# Altium schematic sheet hierarchy.SchDoc
size A3; DocumentNumber: 1; SheetNumber: 1; SheetTotal: 19; SheetDescription: Overview
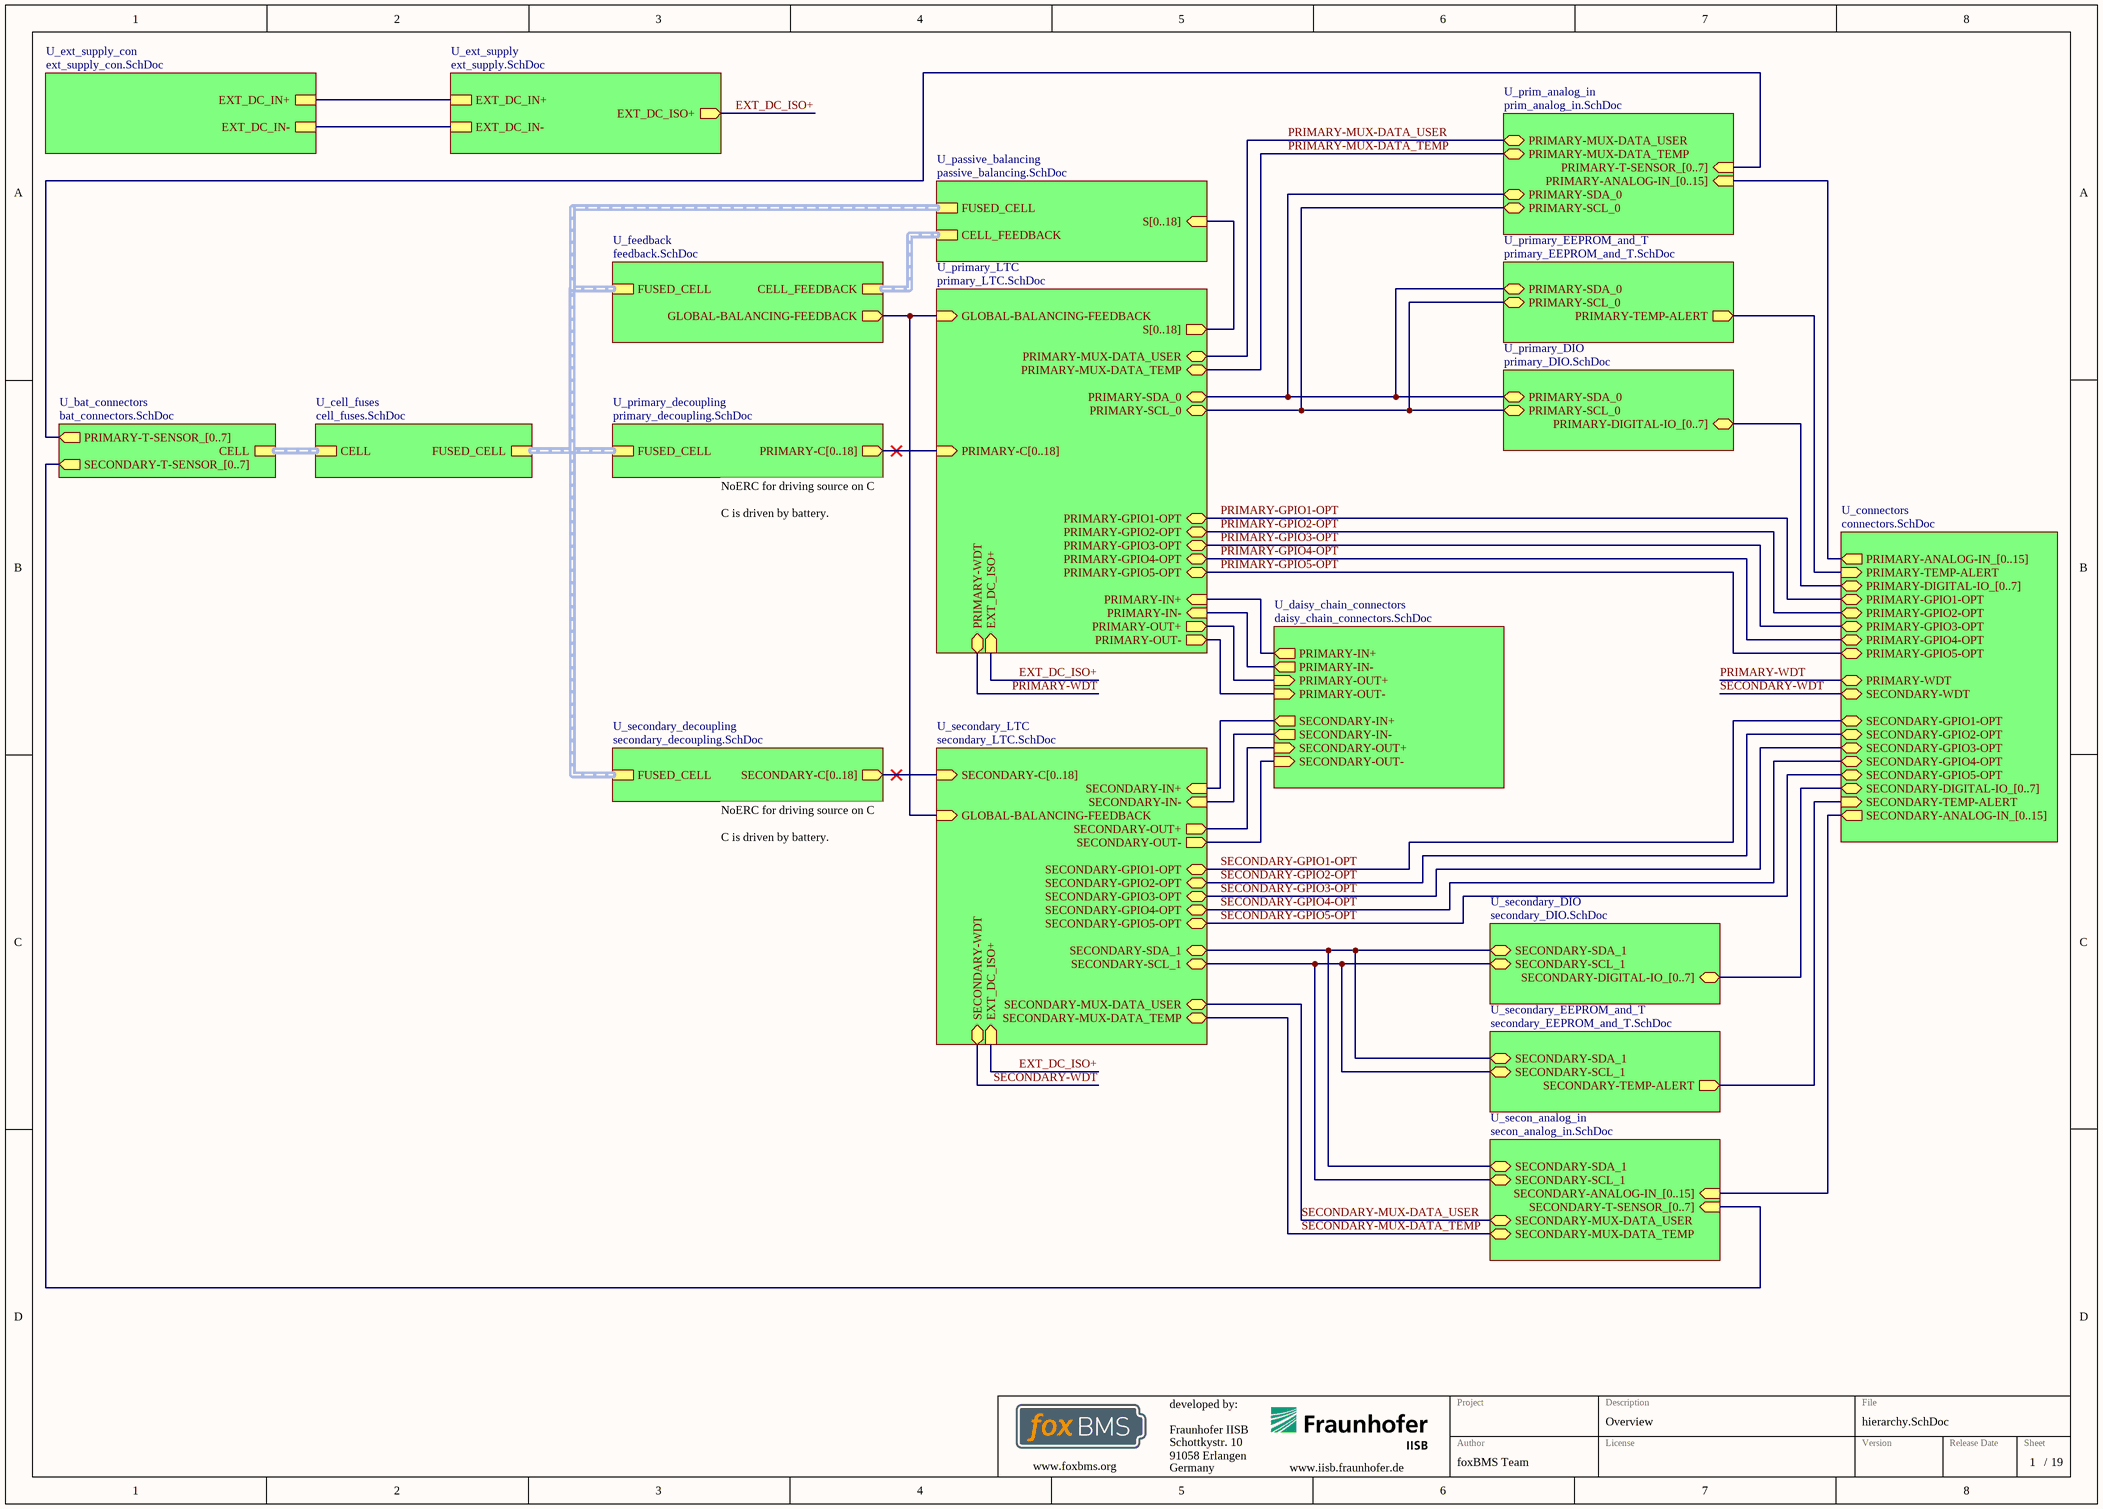
[diagram p0: hierarchy.SchDoc]

## Sub-sheets
U_bat_connectors = bat_connectors.SchDoc: CELL (harness CELL_VOLTAGES), PRIMARY-T-SENSOR_[0..7] (out), SECONDARY-T-SENSOR_[0..7] (out)
U_cell_fuses = cell_fuses.SchDoc: CELL (harness CELL_VOLTAGES), FUSED_CELL (harness CELL_VOLTAGES)
U_connectors = connectors.SchDoc: PRIMARY-WDT (bidir), SECONDARY-WDT (bidir), PRIMARY-GPIO1-OPT (bidir), PRIMARY-GPIO2-OPT (bidir), PRIMARY-GPIO3-OPT (bidir), PRIMARY-GPIO4-OPT (bidir), PRIMARY-GPIO5-OPT (bidir), SECONDARY-GPIO1-OPT (bidir), SECONDARY-GPIO2-OPT (bidir), SECONDARY-GPIO3-OPT (bidir), SECONDARY-GPIO4-OPT (bidir), SECONDARY-GPIO5-OPT (bidir), PRIMARY-TEMP-ALERT (in), SECONDARY-TEMP-ALERT (in), SECONDARY-DIGITAL-IO_[0..7] (bidir), PRIMARY-DIGITAL-IO_[0..7] (bidir), PRIMARY-ANALOG-IN_[0..15] (out), SECONDARY-ANALOG-IN_[0..15] (out)
U_daisy_chain_connectors = daisy_chain_connectors.SchDoc: SECONDARY-IN+ (out), SECONDARY-IN- (out), SECONDARY-OUT+ (in), SECONDARY-OUT- (in), PRIMARY-IN+ (out), PRIMARY-IN- (out), PRIMARY-OUT- (in), PRIMARY-OUT+ (in)
U_ext_supply = ext_supply.SchDoc: EXT_DC_IN+, EXT_DC_IN-, EXT_DC_ISO+ (out)
U_ext_supply_con = ext_supply_con.SchDoc: EXT_DC_IN+, EXT_DC_IN-
U_feedback = feedback.SchDoc: GLOBAL-BALANCING-FEEDBACK (out), CELL_FEEDBACK (harness CELL_FEEDBACK), FUSED_CELL (harness CELL_VOLTAGES)
U_passive_balancing = passive_balancing.SchDoc: FUSED_CELL (harness CELL_VOLTAGES), S[0..18] (in), CELL_FEEDBACK (harness CELL_FEEDBACK)
U_prim_analog_in = prim_analog_in.SchDoc: PRIMARY-MUX-DATA_TEMP (bidir), PRIMARY-MUX-DATA_USER (bidir), PRIMARY-ANALOG-IN_[0..15] (in), PRIMARY-T-SENSOR_[0..7] (in), PRIMARY-SCL_0 (bidir), PRIMARY-SDA_0 (bidir)
U_primary_decoupling = primary_decoupling.SchDoc: FUSED_CELL (harness CELL_VOLTAGES), PRIMARY-C[0..18] (out)
U_primary_DIO = primary_DIO.SchDoc: PRIMARY-SCL_0 (bidir), PRIMARY-SDA_0 (bidir), PRIMARY-DIGITAL-IO_[0..7] (bidir)
U_primary_EEPROM_and_T = primary_EEPROM_and_T.SchDoc: PRIMARY-TEMP-ALERT (out), PRIMARY-SCL_0 (bidir), PRIMARY-SDA_0 (bidir)
U_primary_LTC = primary_LTC.SchDoc: PRIMARY-IN- (in), PRIMARY-IN+ (in), PRIMARY-OUT- (out), PRIMARY-OUT+ (out), PRIMARY-GPIO5-OPT (bidir), PRIMARY-GPIO4-OPT (bidir), PRIMARY-MUX-DATA_USER (bidir), PRIMARY-GPIO1-OPT (bidir), PRIMARY-SCL_0 (bidir), PRIMARY-GPIO2-OPT (bidir), PRIMARY-MUX-DATA_TEMP (bidir), PRIMARY-GPIO3-OPT (bidir), GLOBAL-BALANCING-FEEDBACK (in), PRIMARY-SDA_0 (bidir), EXT_DC_ISO+ (in), PRIMARY-C[0..18] (in), S[0..18] (out), PRIMARY-WDT (bidir)
U_secon_analog_in = secon_analog_in.SchDoc: SECONDARY-MUX-DATA_TEMP (bidir), SECONDARY-MUX-DATA_USER (bidir), SECONDARY-ANALOG-IN_[0..15] (in), SECONDARY-T-SENSOR_[0..7] (in), SECONDARY-SCL_1 (bidir), SECONDARY-SDA_1 (bidir)
U_secondary_decoupling = secondary_decoupling.SchDoc: FUSED_CELL (harness CELL_VOLTAGES), SECONDARY-C[0..18] (out)
U_secondary_DIO = secondary_DIO.SchDoc: SECONDARY-SCL_1 (bidir), SECONDARY-SDA_1 (bidir), SECONDARY-DIGITAL-IO_[0..7] (bidir)
U_secondary_EEPROM_and_T = secondary_EEPROM_and_T.SchDoc: SECONDARY-TEMP-ALERT (out), SECONDARY-SDA_1 (bidir), SECONDARY-SCL_1 (bidir)
U_secondary_LTC = secondary_LTC.SchDoc: SECONDARY-GPIO5-OPT (bidir), SECONDARY-GPIO4-OPT (bidir), SECONDARY-MUX-DATA_USER (bidir), SECONDARY-GPIO1-OPT (bidir), SECONDARY-SDA_1 (bidir), SECONDARY-SCL_1 (bidir), SECONDARY-MUX-DATA_TEMP (bidir), SECONDARY-GPIO2-OPT (bidir), SECONDARY-GPIO3-OPT (bidir), GLOBAL-BALANCING-FEEDBACK (in), EXT_DC_ISO+ (in), SECONDARY-IN- (in), SECONDARY-IN+ (in), SECONDARY-OUT- (out), SECONDARY-OUT+ (out), SECONDARY-C[0..18] (in), SECONDARY-WDT (bidir)

## Nets
EXT_DC_ISO+: sheet U_ext_supply/EXT_DC_ISO+, sheet U_primary_LTC/EXT_DC_ISO+, sheet U_secondary_LTC/EXT_DC_ISO+
PRIMARY-GPIO1-OPT: sheet U_connectors/PRIMARY-GPIO1-OPT, sheet U_primary_LTC/PRIMARY-GPIO1-OPT
PRIMARY-GPIO2-OPT: sheet U_connectors/PRIMARY-GPIO2-OPT, sheet U_primary_LTC/PRIMARY-GPIO2-OPT
PRIMARY-GPIO3-OPT: sheet U_connectors/PRIMARY-GPIO3-OPT, sheet U_primary_LTC/PRIMARY-GPIO3-OPT
PRIMARY-GPIO4-OPT: sheet U_connectors/PRIMARY-GPIO4-OPT, sheet U_primary_LTC/PRIMARY-GPIO4-OPT
PRIMARY-GPIO5-OPT: sheet U_connectors/PRIMARY-GPIO5-OPT, sheet U_primary_LTC/PRIMARY-GPIO5-OPT
PRIMARY-MUX-DATA_TEMP: sheet U_primary_LTC/PRIMARY-MUX-DATA_TEMP, sheet U_prim_analog_in/PRIMARY-MUX-DATA_TEMP
PRIMARY-MUX-DATA_USER: sheet U_primary_LTC/PRIMARY-MUX-DATA_USER, sheet U_prim_analog_in/PRIMARY-MUX-DATA_USER
PRIMARY-WDT: sheet U_connectors/PRIMARY-WDT, sheet U_primary_LTC/PRIMARY-WDT
SECONDARY-GPIO1-OPT: sheet U_connectors/SECONDARY-GPIO1-OPT, sheet U_secondary_LTC/SECONDARY-GPIO1-OPT
SECONDARY-GPIO2-OPT: sheet U_connectors/SECONDARY-GPIO2-OPT, sheet U_secondary_LTC/SECONDARY-GPIO2-OPT
SECONDARY-GPIO3-OPT: sheet U_connectors/SECONDARY-GPIO3-OPT, sheet U_secondary_LTC/SECONDARY-GPIO3-OPT
SECONDARY-GPIO4-OPT: sheet U_connectors/SECONDARY-GPIO4-OPT, sheet U_secondary_LTC/SECONDARY-GPIO4-OPT
SECONDARY-GPIO5-OPT: sheet U_connectors/SECONDARY-GPIO5-OPT, sheet U_secondary_LTC/SECONDARY-GPIO5-OPT
SECONDARY-MUX-DATA_TEMP: sheet U_secondary_LTC/SECONDARY-MUX-DATA_TEMP, sheet U_secon_analog_in/SECONDARY-MUX-DATA_TEMP
SECONDARY-MUX-DATA_USER: sheet U_secondary_LTC/SECONDARY-MUX-DATA_USER, sheet U_secon_analog_in/SECONDARY-MUX-DATA_USER
SECONDARY-WDT: sheet U_connectors/SECONDARY-WDT, sheet U_secondary_LTC/SECONDARY-WDT
(unnamed): sheet U_ext_supply/EXT_DC_IN+, sheet U_ext_supply_con/EXT_DC_IN+
(unnamed): sheet U_ext_supply/EXT_DC_IN-, sheet U_ext_supply_con/EXT_DC_IN-
(unnamed): sheet U_connectors/PRIMARY-TEMP-ALERT, sheet U_primary_EEPROM_and_T/PRIMARY-TEMP-ALERT
(unnamed): sheet U_connectors/SECONDARY-TEMP-ALERT, sheet U_secondary_EEPROM_and_T/SECONDARY-TEMP-ALERT
(unnamed): sheet U_feedback/GLOBAL-BALANCING-FEEDBACK, sheet U_primary_LTC/GLOBAL-BALANCING-FEEDBACK, sheet U_secondary_LTC/GLOBAL-BALANCING-FEEDBACK
(unnamed): sheet U_primary_LTC/PRIMARY-IN-, sheet U_daisy_chain_connectors/PRIMARY-IN-
(unnamed): sheet U_primary_LTC/PRIMARY-IN+, sheet U_daisy_chain_connectors/PRIMARY-IN+
(unnamed): sheet U_primary_LTC/PRIMARY-OUT-, sheet U_daisy_chain_connectors/PRIMARY-OUT-
(unnamed): sheet U_primary_LTC/PRIMARY-OUT+, sheet U_daisy_chain_connectors/PRIMARY-OUT+
(unnamed): sheet U_primary_LTC/PRIMARY-SCL_0, sheet U_primary_DIO/PRIMARY-SCL_0, sheet U_primary_EEPROM_and_T/PRIMARY-SCL_0, sheet U_prim_analog_in/PRIMARY-SCL_0
(unnamed): sheet U_primary_LTC/PRIMARY-SDA_0, sheet U_primary_DIO/PRIMARY-SDA_0, sheet U_primary_EEPROM_and_T/PRIMARY-SDA_0, sheet U_prim_analog_in/PRIMARY-SDA_0
(unnamed): sheet U_secondary_LTC/SECONDARY-SDA_1, sheet U_secondary_DIO/SECONDARY-SDA_1, sheet U_secondary_EEPROM_and_T/SECONDARY-SDA_1, sheet U_secon_analog_in/SECONDARY-SDA_1
(unnamed): sheet U_secondary_LTC/SECONDARY-SCL_1, sheet U_secondary_DIO/SECONDARY-SCL_1, sheet U_secondary_EEPROM_and_T/SECONDARY-SCL_1, sheet U_secon_analog_in/SECONDARY-SCL_1
(unnamed): sheet U_secondary_LTC/SECONDARY-IN-, sheet U_daisy_chain_connectors/SECONDARY-IN-
(unnamed): sheet U_secondary_LTC/SECONDARY-IN+, sheet U_daisy_chain_connectors/SECONDARY-IN+
(unnamed): sheet U_secondary_LTC/SECONDARY-OUT-, sheet U_daisy_chain_connectors/SECONDARY-OUT-
(unnamed): sheet U_secondary_LTC/SECONDARY-OUT+, sheet U_daisy_chain_connectors/SECONDARY-OUT+

## Buses and harness runs
bus sheet U_bat_connectors/PRIMARY-T-SENSOR_[0..7] = sheet U_prim_analog_in/PRIMARY-T-SENSOR_[0..7]
bus sheet U_bat_connectors/SECONDARY-T-SENSOR_[0..7] = sheet U_secon_analog_in/SECONDARY-T-SENSOR_[0..7]
bus sheet U_connectors/PRIMARY-ANALOG-IN_[0..15] = sheet U_prim_analog_in/PRIMARY-ANALOG-IN_[0..15]
bus sheet U_connectors/PRIMARY-DIGITAL-IO_[0..7] = sheet U_primary_DIO/PRIMARY-DIGITAL-IO_[0..7]
bus sheet U_connectors/SECONDARY-ANALOG-IN_[0..15] = sheet U_secon_analog_in/SECONDARY-ANALOG-IN_[0..15]
bus sheet U_connectors/SECONDARY-DIGITAL-IO_[0..7] = sheet U_secondary_DIO/SECONDARY-DIGITAL-IO_[0..7]
bus sheet U_passive_balancing/S[0..18] = sheet U_primary_LTC/S[0..18]
bus sheet U_primary_decoupling/PRIMARY-C[0..18] = sheet U_primary_LTC/PRIMARY-C[0..18]
bus sheet U_secondary_decoupling/SECONDARY-C[0..18] = sheet U_secondary_LTC/SECONDARY-C[0..18]
harness sheet U_bat_connectors/CELL = sheet U_cell_fuses/CELL
harness sheet U_cell_fuses/FUSED_CELL = sheet U_feedback/FUSED_CELL = sheet U_passive_balancing/FUSED_CELL = sheet U_primary_decoupling/FUSED_CELL = sheet U_secondary_decoupling/FUSED_CELL
harness sheet U_feedback/CELL_FEEDBACK = sheet U_passive_balancing/CELL_FEEDBACK

## Notes on the sheet
- NoERC for driving source on C
  C is driven by battery.
- Fraunhofer IISB
- Schottkystr. 10
- developed by:
- 91058 Erlangen
- Germany
- Author
- Project
- License
- Description
- File
- Version
- Release Date
- Sheet
- www.foxbms.org
- www.iisb.fraunhofer.de
- foxBMS Team
- /